# EAGLE board raspi_zero_power_sensor_hat (EAGLE 7.7.0)
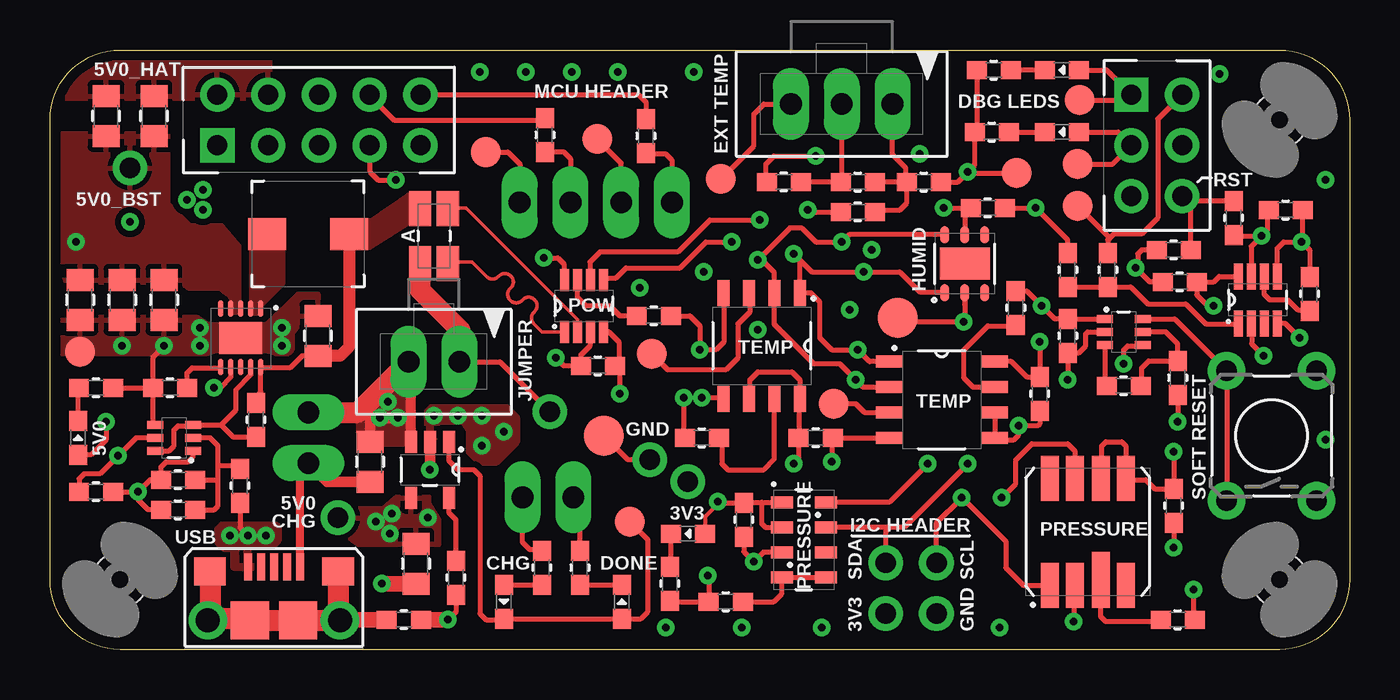
[diagram p7: board, top side]
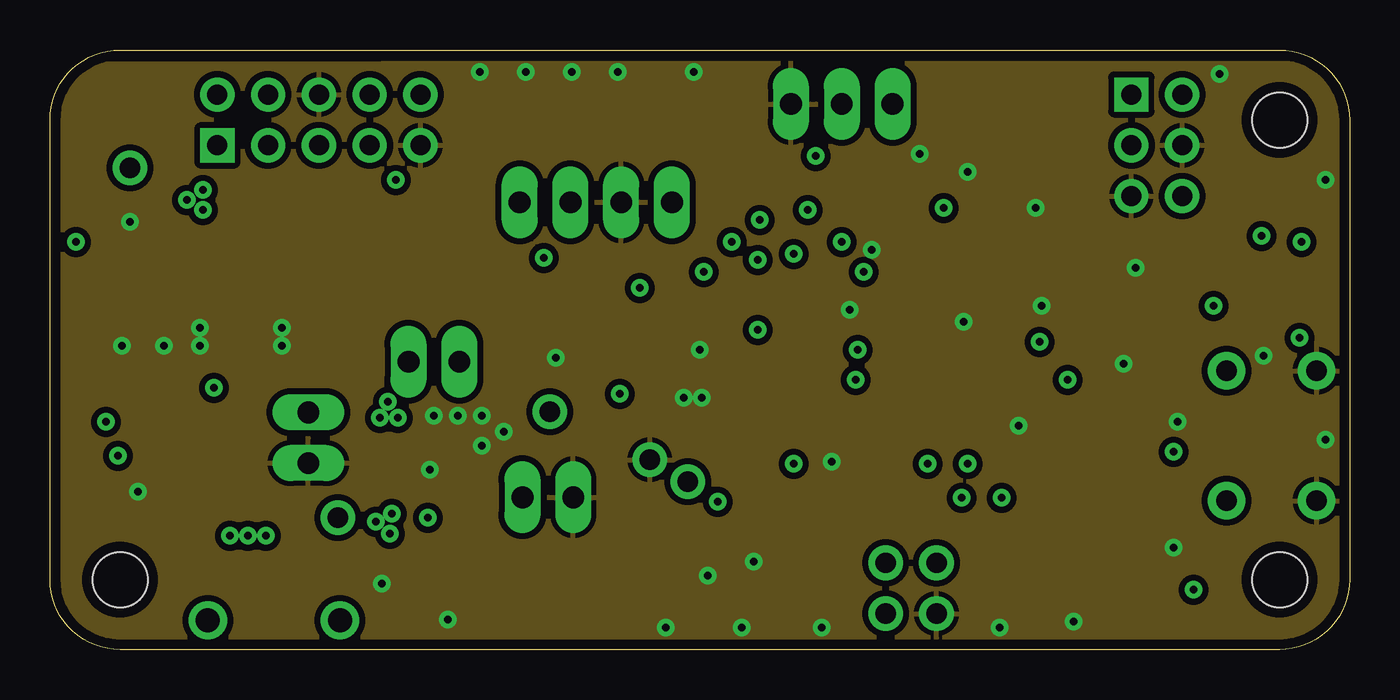
[diagram p8: board, inner layer GND]
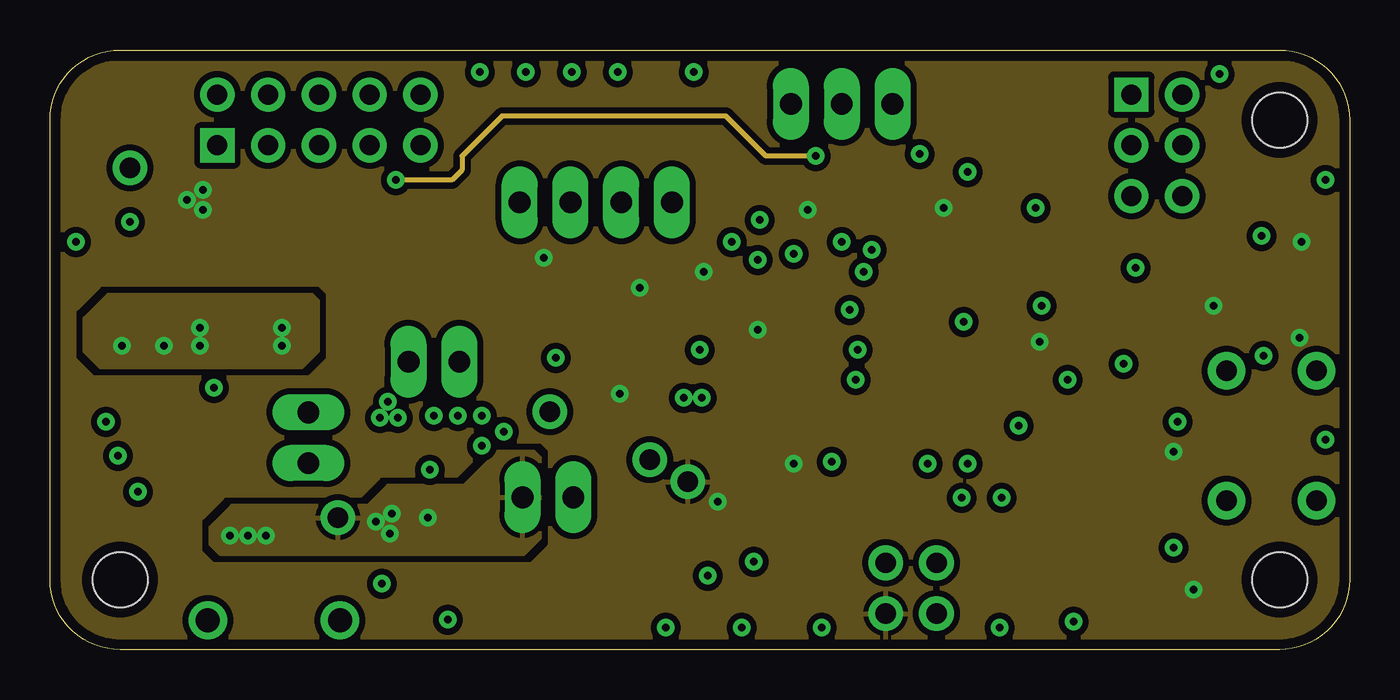
[diagram p9: board, inner layer PWR]
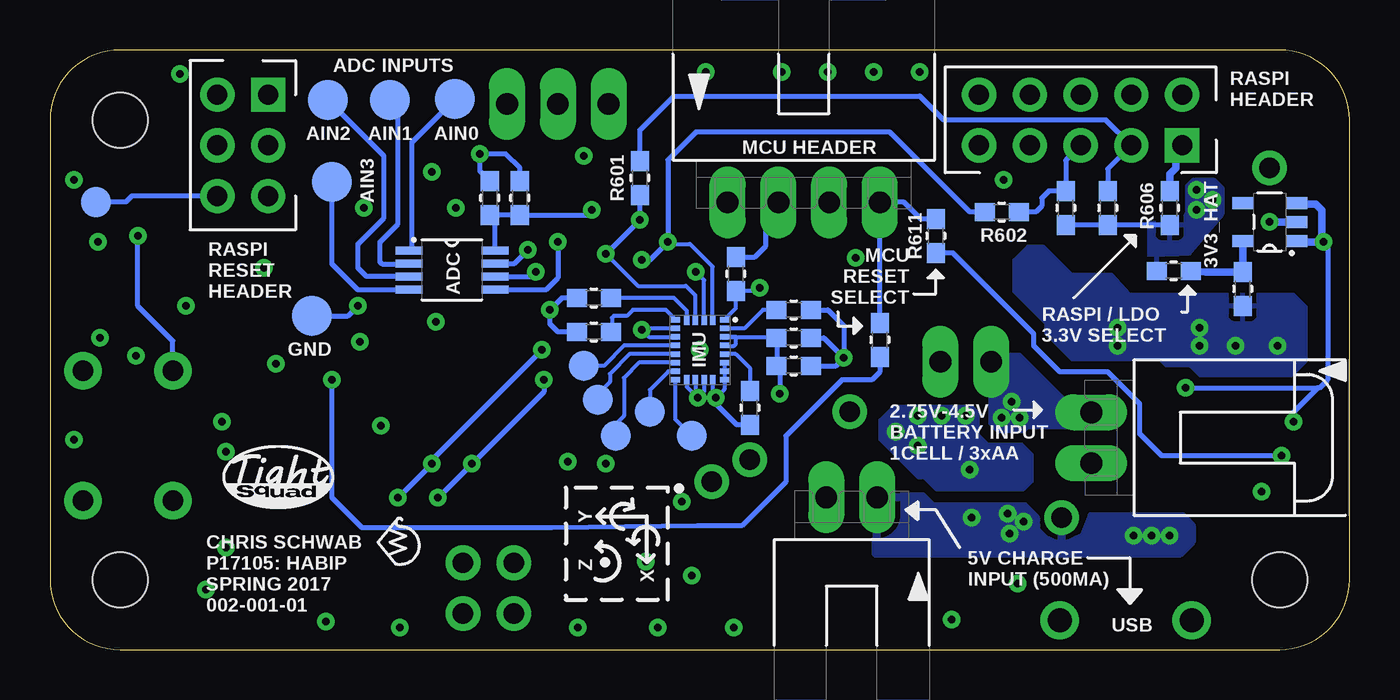
[diagram p10: board, bottom side, seen from below]

Size 65 x 30 mm. Coordinates in mm from the lower left corner, seen from the top.
Outline: 3.5,0 arc-90 0,3.5 0,26.5 arc-90 3.5,30 61.5,30 arc-90 65,26.5 65,3.5 arc-90 61.5,0 3.5,0
Copper layers (1+2*15+16): Top 0.035mm / dielectric 0.486mm / GND 0.035mm / dielectric 0.488mm / PWR 0.035mm / dielectric 0.486mm / Bottom 0.035mm
Design rules "4layer_4pcb": minimum track width 6mil, minimum drill 15mil, track to track 6mil, track to pad 6mil, pad to pad 6mil, via to via 6mil, smd to smd 6mil, copper to edge 20mil, drill to drill 10mil, minimum pad ring 14mil, minimum via ring 10mil, stop-mask expansion 2.5mil, vias tented up to drill 16mil, thermal gap 10mil
Net classes: 0 default: drill 0.381 mm, clearance 0.152 mm; 1 diff_pair: width 0.178 mm, drill 0.381 mm, clearance 0.178 mm

## Footprints (pad centres in the part's own frame; a part is rotated, then mirrored left to right if it is on the bottom)
C0805 = smd 1.1 x 1.35: 1 -1,0; 2 1,0
C0603 = smd 1 x 0.9: 1 -0.85,0; 2 0.85,0
LED0603 = smd 1 x 0.9: 1 -0.85,0; 2 0.85,0
R0603 = smd 1 x 0.9: 1 -0.85,0; 2 0.85,0
MOLSL-2-RA_HALF = drill 1.09 long: 1 -1.27,-7.62; 2 1.27,-7.62
MICROUSB-RIGHT = smd 0.4 x 1.35: 1 -1.3,2.675; 2 -0.65,2.675; 3 0,2.675; 4 0.65,2.675; 5 1.3,2.675 | drill 1.2 pad 1.6: S1 -3.3,0; S2 3.3,0 | smd 1.6 x 1.4: S3 -3.2,2.45; S4 3.2,2.45 | smd 1.9 x 1.9: S5 -1.2,0; S6 1.2,0
MOLSL-2-RA = drill 1.09 long: 1 -1.27,-7.62; 2 1.27,-7.62
MOLSL-2-V = drill 1.09 long: 1 -1.27,0; 2 1.27,0
RECEPTACLE-2X5-254MM = drill 1 pad 1.5 square: 1 -5.08,-1.27 | drill 1 pad 1.5: 2 -5.08,1.27; 3 -2.54,-1.27; 4 -2.54,1.27; 5 0,-1.27; 6 0,1.27; 7 2.54,-1.27; 8 2.54,1.27; 9 5.08,-1.27; 10 5.08,1.27
MOLSL-4-RA_HALF = drill 1.09 long: 1 -3.81,-7.62; 2 -1.27,-7.62; 3 1.27,-7.62; 4 3.81,-7.62
MOLSL-3-V = drill 1.09 long: 1 -2.54,0; 2 0,0; 3 2.54,0
RECEPTACLE-2X3-254MM = drill 1 pad 1.5 square: 1 -2.54,-1.27 | drill 1 pad 1.5: 2 -2.54,1.27; 3 0,-1.27; 4 0,1.27; 5 2.54,-1.27; 6 2.54,1.27
SMD410P190X160-2N = smd 1.9 x 1.6: 1 -2.05,0; 2 2.05,0
RASPI_ZERO_3STANDOFFS_ONLY = hole 2.75: 3.5,3.5; 61.5,3.5; 61.5,26.5
SOT363P080X040-6N = smd 0.8 x 0.4: 1 -0.95,0.65; 2 -0.95,0; 3 -0.95,-0.65; 4 0.95,-0.65; 5 0.95,0; 6 0.95,0.65
RS1206 = smd 1.75 x 1.1: 1A -1.375,-0.7; 1V -1.375,0.7; 2A 1.375,-0.7; 2V 1.375,0.7
R0805 = smd 1.1 x 1.35: 1 -1,0; 2 1,0
TACTILE-PTH = drill 1.016 pad 1.88: 1 3.25,-2.25; 2 -3.25,-2.25; 3 3.25,2.25; 4 -3.25,2.25
TP_TH102 = drill 1.02: 1 0,0
TP20R = smd 2 x 2: TP 0,0
TP15R = smd 1.5 x 1.5: TP 0,0
SOT23P110X060-5N = smd 1.1 x 0.6: 1 -1.4,0.95; 2 -1.4,0; 3 -1.4,-0.95; 4 1.4,-0.95; 5 1.4,0.95
SOT23P130X045-8N = smd 1.3 x 0.45: 1 -1.175,0.975; 2 -1.175,0.325; 3 -1.175,-0.325; 4 -1.175,-0.975; 5 1.175,-0.975; 6 1.175,-0.325; 7 1.175,0.325; 8 1.175,0.975
SOT23P105X060-5N = smd 1.05 x 0.6: 1 -1.35,0.95; 2 -1.35,0; 3 -1.35,-0.95; 4 1.35,-0.95; 5 1.35,0.95
DRC0010G_SM = smd 0.825 x 0.28: 1 -1.462,1; 2 -1.462,0.5; 3 -1.462,0; 4 -1.462,-0.5; 5 -1.462,-1; 6 1.462,-1; 7 1.462,-0.5; 8 1.462,0; 9 1.462,0.5; 10 1.462,1 | smd 1.6 x 2.15: 11 0,0
SOIC127P130X0600-8N = smd 1.3 x 0.6: 1 -2.65,1.905; 2 -2.65,0.635; 3 -2.65,-0.635; 4 -2.65,-1.905; 5 2.65,-1.905; 6 2.65,-0.635; 7 2.65,0.635; 8 2.65,1.905
SOP65P135X040-8N = smd 1.35 x 0.4: 1 -2.15,0.975; 2 -2.15,0.325; 3 -2.15,-0.325; 4 -2.15,-0.975; 5 2.15,-0.975; 6 2.15,-0.325; 7 2.15,0.325; 8 2.15,0.975
SOT65P110X045-8N = smd 1.1 x 0.45: 1 -1.3,0.975; 2 -1.3,0.325; 3 -1.3,-0.325; 4 -1.3,-0.975; 5 1.3,-0.975; 6 1.3,-0.325; 7 1.3,0.325; 8 1.3,0.975
LGA043P045X033-24N = smd 0.275 x 0.45: 1 -1.505,1.225; 6 -1.505,-1.225; 7 -1.075,-1.225; 8 -0.645,-1.225; 9 -0.215,-1.225; 10 0.215,-1.225; 11 0.645,-1.225; 12 1.075,-1.225; 13 1.505,-1.225; 18 1.505,1.225; 19 1.075,1.225; 20 0.645,1.225; 21 0.215,1.225; 22 -0.215,1.225; 23 -0.645,1.225; 24 -1.075,1.225 | smd 0.45 x 0.275: 2 -1.475,0.645; 3 -1.475,0.215; 4 -1.475,-0.215; 5 -1.475,-0.645; 14 1.475,-0.645; 15 1.475,-0.215; 16 1.475,0.215; 17 1.475,0.645
SMD125P110X060-8N = smd 1.1 x 0.6: 1 -1.1,1.875; 2 -1.1,0.625; 3 -1.1,-0.625; 4 -1.1,-1.875; 5 1.1,-1.875; 6 1.1,-0.625; 7 1.1,0.625; 8 1.1,1.875
SMD125130P225X090-8N = smd 2.25 x 0.9: 1 -2.675,1.9; 2 -2.675,0.65; 4 -2.675,-1.9; 5 2.675,-1.9; 6 2.675,-0.65; 7 2.675,0.65; 8 2.675,1.9 | smd 2.8 x 0.9: 3 -2.4,-0.65
DFN-100P085X045-T-6N = smd 0.85 x 0.45: 1 -1.45,1; 2 -1.45,0; 3 -1.45,-1; 4 1.45,-1; 5 1.45,0; 6 1.45,1 | smd 1.6 x 2.5: PAD 0,0

## Placement (x,y rotation side)
BOM701  SL 70066 2PIN HOUSING  [BLANK]  61.72,10.1 90 top
BOM702  SL 70058 GOLD CRIMP  [BLANK]  61.73,10 90 top
BOM703  SL 70058 GOLD CRIMP  [BLANK]  61.84,10.1 90 top
BOM704  SL 70066 2PIN HOUSING  [BLANK]  61.75,10 90 top
BOM705  SL 70058 GOLD CRIMP  [BLANK]  61.76,10 90 top
BOM706  SL 70058 GOLD CRIMP  [BLANK]  61.57,10 90 top
BOM707  SL 70066 2PIN HOUSING  [BLANK]  61.8,10.1 90 top
BOM708  SL 70058 GOLD CRIMP  [BLANK]  61.7,10.1 90 top
BOM709  SL 70058 GOLD CRIMP  [BLANK]  61.6,10.1 90 top
BOM710  HEADER-RECT-MALE-2X5  [BLANK]  61.75,10 90 top
BOM711  SL 70066 4PIN HOUSING  [BLANK]  61.7,10 90 top
BOM712  SL 70058 GOLD CRIMP  [BLANK]  61.65,10.1 90 top
BOM713  SL 70058 GOLD CRIMP  [BLANK]  61.76,10.1 90 top
BOM714  SL 70058 GOLD CRIMP  [BLANK]  61.68,10.1 90 top
BOM715  SL 70058 GOLD CRIMP  [BLANK]  61.69,10 90 top
BOM716  SL 70066 3PIN HOUSING  [BLANK]  61.62,10 90 top
BOM717  SL 70058 GOLD CRIMP  [BLANK]  61.73,10 90 top
BOM718  SL 70058 GOLD CRIMP  [BLANK]  61.74,10.1 90 top
BOM719  SL 70058 GOLD CRIMP  [BLANK]  61.75,10 90 top
BOM720  1-Wire Temperature Sensor  [BLANK]  61.76,10 90 top
BOM721  1-Wire Temperature Sensor  [BLANK]  61.67,10 90 top
BOM722  HEADER-RECT-MALE-2X3  [BLANK]  61.69,10.1 90 top
C301  10uF  [C0805]  18.3,4.3 270 top
C302  100nF  [C0603]  56.5,18.4 180 top
C401  10uF  [C0805]  16,9.4 270 top
C402  100nF  [C0603]  5.35,18.05 270 bottom
C403  22uF  [C0805]  13.4,15.7 90 top
C404  2.2uF  [C0603]  6.4,8.5 180 top
C405  18nF  [C0603]  6,13.1 180 top
C406  10uF  [C0805]  5.7,17.5 270 top
C407  10uF  [C0805]  3.6,17.5 270 top
C408  10uF  [C0805]  1.5,17.5 270 top
C501  100nF  [C0603]  49.5,12.8 90 top
C502  100nF  [C0603]  38.3,10.6 180 top
C503  100nF  [C0603]  43,22.6 90 bottom
C504  4.7uF  [C0603]  41.5,22.6 90 bottom
C505  10nF  [C0603]  30,12.1 270 bottom
C506  100nF  [C0603]  27.4,14.2 0 top
C507  100nF  [C0603]  27.8,15.6 0 bottom
C508  100nF  [C0603]  27.8,17 0 bottom
C509  10uF  [C0603]  27.8,14.2 0 bottom
C510  100nF  [C0603]  30.7,18.8 90 bottom
C511  100nF  [C0603]  56.2,7.2 90 top
C512  100nF  [C0603]  34.7,6.5 90 top
C513  100nF  [C0603]  46.9,22.1 180 top
C601  100nF  [C0603]  56.2,20 180 top
C602  100nF  [C0603]  43.7,23.4 0 top
DS301  YELLOW  [LED0603]  22.7,2.4 90 top
DS302  GREEN  [LED0603]  28.6,2.4 270 top
DS401  BLUE  [LED0603]  1.4,10.6 270 top
DS402  YELLOW  [LED0603]  31.9,5.8 0 top
DS601  YELLOW  [LED0603]  50.6,29 0 top
DS602  YELLOW  [LED0603]  50.6,25.9 0 top
F601  FUSE-50MA  [R0603]  40.4,21.9 180 top
J301  MOL-SL-2-RA  [MOLSL-2-RA_HALF]  24.9,0 180 bottom
J302  USB_MICROB_RECPT  [MICROUSB-RIGHT]  11.2,1.47 0 top
J401  MOL-SL-2-RA  [MOLSL-2-RA]  5.3,10.6 270 bottom
J402  MOL-SL-2-V  [MOLSL-2-V]  19.2,14.4 180 top
J601  RECEPTACLE-2x5-2.54MM  [RECEPTACLE-2X5-254MM]  13.45,26.5 0 top
J602  MOL-SL-4-RA  [MOLSL-4-RA_HALF]  27.3,30 0 bottom
J603  MOL-SL-3-V  [MOLSL-3-V]  39.6,27.3 180 top
J604  RECEPTACLE-2x3-2.54MM  [RECEPTACLE-2X3-254MM]  55.36,25.23 270 top
L401  1.0uH  [SMD410P190X160-2N]  12.9,20.8 180 top
LOGO601  [CMS_LOGO]  48.3,4.5 0 bottom
LOGO602  [SQUAD_LOGO]  56.4,7 0 bottom
OUTLINE601  RASPI_ZERO_OUTLINE_3S0C_ONLY  [RASPI_ZERO_3STANDOFFS_ONLY]  0,0 0 top
Q301  SSM6N7002KFU  [SOT363P080X040-6N]  53.7,15.9 0 top
Q401  SSM6N7002KFU  [SOT363P080X040-6N]  6.2,10.6 180 top
R301  0.0  [R0603]  17.7,1.5 180 top
R302  2k  [R0603]  20.3,3.6 90 top
R303  2k  [R0603]  24.6,4.1 90 top
R304  2k  [R0603]  26.5,4.1 270 top
R305  0.0  [R0603]  53.7,13.2 180 top
R306  0.0  [R0603]  56.4,13.6 270 top
R307  0.0  [R0603]  52.9,19 270 top
R308  0.0  [R0603]  63,17.8 90 top
R309  10k  [R0603]  50.9,19 270 top
R310  10k  [R0603]  50.9,15.7 270 top
R311  10k  [R0603]  61.8,22 0 top
R312  49.9  [R0603]  59.2,21.6 90 top
R401  0.0  [R0603]  8.8,18.95 180 bottom
R402  0.033  [RS1206]  19.2,20.7 270 top
R403  49.9  [R0603]  9.5,8.2 90 top
R404  10k  [R0603]  6.4,7 0 top
R405  10k  [R0603]  10.3,11.5 90 top
R406  10k  [R0603]  2.3,7.9 180 top
R407  2k  [R0603]  2.3,13.1 180 top
R408  0.0  [R0805]  5.2,26.7 90 top
R409  0.0  [R0805]  2.8,26.7 90 top
R410  2k  [R0603]  31,3.3 90 top
R501  0.0  [R0603]  32.6,10.6 0 top
R502  0.0  [R0603]  48.3,17.1 270 top
R503  0.0  [R0603]  37.8,15.9 0 bottom
R504  0.0  [R0603]  30.2,16.7 180 top
R505  0.0  [R0603]  37.8,17.6 0 bottom
R506  0.0  [R0603]  56.4,1.5 0 top
R507  0.0  [R0603]  33.8,2.4 0 top
R601  0.0  [R0603]  35.5,23.6 90 bottom
R602  0.0  [R0603]  17.4,21.9 0 bottom
R603  2k  [R0603]  12.1,22.1 270 bottom
R604  2k  [R0603]  14.2,22.1 270 bottom
R605  0.0  [R0603]  36.7,23.4 180 top
R606  0.0  [R0603]  9,22.1 90 bottom
R607  2k  [R0603]  47.2,29 0 top
R608  2k  [R0603]  47.1,25.9 0 top
R609  0.0  [R0603]  24.75,25.75 270 top
R610  0.0  [R0603]  29.8,25.7 270 top
R611  0.0  [R0603]  20.7,20.7 270 bottom
R612  0.0  [R0603]  23.5,15.5 270 bottom
R613  4.7k  [R0603]  40.4,23.4 0 top
S301  PB  [TACTILE-PTH]  61.1,10.7 90 top
TP301  [TP_TH102]  14.4,6.6 0 top
TP302  [TP_TH102]  30,9.5 0 top
TP303  [TP20R]  27.7,10.7 0 top
TP304  [TP15R]  29,6.4 0 top
TP401  [TP_TH102]  25,11.9 0 top
TP402  [TP_TH102]  31.9,8.4 0 top
TP403  [TP_TH102]  4,24.1 0 top
TP404  [TP15R]  1.5,14.9 0 top
TP501  [TP20R]  50.9,23.4 180 bottom
TP502  [TP20R]  51.1,27.5 180 bottom
TP503  [TP20R]  48,27.5 180 bottom
TP504  [TP20R]  44.75,27.55 180 bottom
TP505  [TP20R]  51.9,16.7 180 bottom
TP506  [TP15R]  39.2,12.3 0 top
TP507  [TP15R]  30.1,14.8 0 top
TP508  [TP15R]  38.3,14.2 0 bottom
TP509  [TP15R]  37.6,12.5 0 bottom
TP510  [TP15R]  36.7,10.7 0 bottom
TP511  [TP15R]  35,11.9 0 bottom
TP512  [TP15R]  32.9,10.7 0 bottom
TP513  [TP20R]  42.4,16.6 0 top
TP601  [TP_TH102]  41.8,1.8 0 top
TP602  [TP_TH102]  41.8,4.34 0 top
TP603  [TP_TH102]  44.34,4.34 0 top
TP604  [TP_TH102]  44.34,1.8 0 top
TP605  [TP15R]  51.5,27.5 0 top
TP606  [TP15R]  51.4,24.3 0 top
TP607  [TP15R]  21.81,24.89 90 top
TP608  [TP15R]  27.37,25.55 90 top
TP609  [TP15R]  51.4,22.2 90 top
TP610  [TP15R]  33.56,23.55 90 top
TP611  [TP15R]  62.71,22.39 90 bottom
TP612  [TP15R]  48.35,23.85 90 top
U301  MCP73831T-2AC  [SOT23P110X060-5N]  19,9 270 top
U302  MAX6371  [SOT23P130X045-8N]  60.4,17.5 90 top
U401  TLV71333P  [SOT23P105X060-5N]  4,21.4 180 bottom
U402  TPS61232  [DRC0010G_SM]  9.54,15.6 270 top
U501  PCT2075D,118  [SOIC127P130X0600-8N]  44.6,12.5 0 top
U502  PCT2075D,118  [SOIC127P130X0600-8N]  35.6,15.2 270 top
U503  MAX11613EUA+  [SOP65P135X040-8N]  44.9,19 0 bottom
U504  INA219AIDCNR  [SOT65P110X045-8N]  26.7,17.2 90 top
U505  LSM9DS1TR  [LGA043P045X033-24N]  32.5,15 270 bottom
U506  MS560702BA03-50  [SMD125P110X060-8N]  37.7,5.5 0 top
U507  MS580305BA01  [SMD125130P225X090-8N]  51.9,5.9 90 top
U508  SI7021  [DFN-100P085X045-T-6N]  45.75,19.31 90 top

## Tracks (layer width: path | path; a pad name or v marks a point on that pad's centre or on a via)
3V3_HAT_PG
  Top 0.254: 31,5.75 DS402.1 31.05,4.2 R410.2
5V0_BST_PG
  Top 0.203: 1.4,13.05 R407.2
  Top 0.254: DS401.1 1.4,13.05
ADC_AIN0
  Bottom 0.254: TP504.TP 46.9,25.4 46.9,20.12 U503.1
ADC_AIN1
  Bottom 0.254: TP503.TP 47.6,27.1 47.6,21.3 48.5,20.4 48.5,19.4 48.4,19.3 47.08,19.3 U503.2
ADC_AIN2
  Bottom 0.254: TP502.TP 48.3,24.7 48.3,21.6 49.6,20.3 49.6,19.1 49.17,18.68 U503.3
ADC_AIN3_REF
  Bottom 0.254: U503.4 47.08,18 49.6,18 50.9,19.3 TP501.TP
BST_EN
  Top 0.203: 7.1,11.2 Q401.3 | 10.05,10.9 R405.1 10.25,10.9
  Top 0.254: Q401.6 5.95,9.95 6.2,10.2 6.2,11 6.4,11.2 7.1,11.2 | Q401.3 8.55,11.25 | 8.55,11.25 9.15,10.65 R405.1 | 8.55,11.25 9.3,12 9.3,13 10.04,13.74 U402.9
BST_SS
  Top 0.203: C405.1 6.85,13.25
  Top 0.254: 6.85,13.25 6.85,13.85 7.1,14.1 8.5,14.1 U402.6
BST_SW
  pour Top (isolate 0.305, no thermals): 10,21.5 10,16.8 10.6,16.8 10.6,17.2 11.7,18.3 11.7,21.5
CHG_DISABLE_GATE
  Top 0.203: C404.1 7.6,8.5
  Top 0.254: R404.2 8.2,7 8.4,7.2 8.4,8.5 | 8.4,8.5 8.4,9.2 | 8.4,9.2 8.4,10.2 8,10.6 Q401.2 | C404.1 8.4,8.5 | R403.2 9.35,9.2 8.4,9.2
CHG_DONE
  Top 0.254: R304.2 DS302.1
CHG_ON
  Top 0.254: DS301.2 R303.1
CHG_PROG
  Top 0.203: U301.5 19.95,7.25
  Top 0.254: R302.2 20.3,6.5 19.95,6.85 U301.5
CHG_STAT
  Top 0.254: U301.1 19.95,9.45 20.4,9 21.2,9 21.5,8.7 21.5,1.8 21.8,1.5 22.65,1.5 DS301.1 DS302.2 29.55,1.55 29.9,1.9 29.9,5.5 TP304.TP
DBG_LED0
  Top 0.254: DS601.1 R607.2
DBG_LED1
  Top 0.254: R608.2 DS602.1
FET_D
  Top 0.203: 52.75,13.3 R305.2
  Top 0.254: Q301.3 52.75,13.3
FET_G
  Top 0.254: Q301.5 55.8,15.9 56.4,15.3 R306.1 54.95,14.45 54.6,14.1 54.6,13.25 R305.1
GND  (via drill 0.38)
  Top 0.203: 60.1,16.3 U302.2 | 54.6,15.2 Q301.4 | C601.2 55.2,20 | 46.35,26 R608.1 | 32.9,2.45 R507.1 | 18,3.6 C301.2 | 19.1,10.5 U301.2 | 5.25,13 C405.2
  Top 0.254: v53.7,14.3 53.7,15 53.9,15.2 54.6,15.2 | Q301.1 R310.1 50.25,16.55 v49.6,17.2 48.85,17.95 R502.1 | C302.2 55,18.4 v54.3,19.1 54.4,19.2 54.4,19.8 54.6,20 55.2,20 | R607.1 46.35,26 | R406.1 v4.4,7.9 | R410.1 31.05,2.4 R507.1 32.95,3.65 v32.9,3.7 | TP513.TP 42.6,16.4 v45.7,16.4 45.75,16.45 U508.2 45.75,17.25 | TP610.TP 35.2,25.19 35.2,26.8 35.7,27.3 J603.3 | v45.9,23.9 46.25,24.25 R608.1 | C602.2 45.4,23.4 v45.9,23.9 | TP302.1 28.9,9.5 TP303.TP | R302.1 20.3,1.9 v19.9,1.5 | R407.1 C405.2 | Q401.4 5.15,11.35 C405.2 | C405.2 5.15,14.65 v5.7,15.2 | U507.2 51.2,3.17 v51.2,1.4 | C511.1 56.05,6.2 56.2,6.05 v56.2,5.1 | R306.2 v56.4,11.4 | 60.1,16.3 60.1,15.3 v60.7,14.7 | U504.3 27.02,15.22 26.55,14.75 C506.1 25.7,14.2 v25.3,14.6 | v39.1,9.4 39.1,10.55 C502.1 U501.4 | R501.1 31.7,10.65 v31.7,12.6 | v45.9,23.9 45.95,23.85 TP612.TP | C513.1 v49.3,22.1 50.9,20.5 R309.1 | C512.1 34.7,4.9 v35.2,4.4 35.67,4.88 U506.3 | v4.4,7.9 5,8.5 C404.2 5.55,9.15 5.8,9.4 6.9,9.4 7.15,9.65 Q401.1 | R404.1 4.9,7 4.4,7.5 v4.4,7.9 | J602.2 28.57,24.35 TP608.TP | C501.1 49.5,11.3 49.4,11.2 v48.45,11.2 48.45,10.75 48.2,10.5 47.34,10.5 U501.5 U501.6 | U502.5 33.65,12.6 v32.6,12.6 | U502.4 33.7,15.4 33.3,15 v32.5,15 32.5,16.2 32,16.7 R504.1 | R304.1 26.5,7.29 J301.2
  Top 0.4: J302.5 12.5,8.91 J401.2
  Top 0.525: U301.2 v19,9 | C401.2 13.85,8.4 J401.2
  Top 0.781: R301.1 v19.9,1.5 | v16.6,3.3 C301.2
  Bottom 0.203: U505.14 33.15,13.14 v32.6,12.6 | U505.15 32.72,12.71 v32.6,12.6 | U505.16 32.28,12.91 v32.6,12.6 | U505.17 31.86,12.76 v31.7,12.6 31.27,13.03 U505.18 U505.19 U505.20
  Bottom 0.254: R505.1 39.4,17.6 v40,17 40,16.3 39.6,15.9 R503.1 | C509.2 25.7,14.2 v25.3,14.6 | J602.2 29.2,21.75 29.2,20.2 29.75,19.65 C510.2 | TP505.TP 50.1,16.7 v49.6,17.2 | U503.7 41.77,19.32 v41.1,20 | C503.2 43.5,23.95 v43.5,24.8 42.2,24.8 41.5,24.1 C504.2 | C508.2 26.1,17 25.3,16.2 v25.3,14.6 | C507.2 26.3,15.6 v25.3,14.6 | C505.2 30.65,11.25 31.7,12.3 v31.7,12.6
  Bottom 0.381: U401.2 v4,21.4
  other vias: 7.5,15.2 7.5,16.1 11.6,16.1 11.6,15.2 19.2,11.7 21.5,28.9 23.8,28.9 26.1,28.9 28.4,28.9 32.2,28.9 30.8,1.1 34.6,1.1 38.6,1.1 47.5,1.1 63.8,10.5 63.8,23.5 58.5,28.8 3.6,15.2 20.4,11.7 21.6,11.7 22.7,10.9 21.6,10.2
  pour Bottom (isolate 0.305): 11.9,18.8 11,17.8 2.8,17.8 2.2,17.2 2.2,14.4 2.9,13.7 7.5,13.7 8,14.2 9.2,14.2 9.5,14.5 13.9,14.5 15.2,15.8 15.2,16.3 16.8,17.9 16.8,19.5 16.1,20.2 15.3,20.2 13.9,18.8
  pour Top: 7.94,16.27 10.8,16.27 12.4,17.8 13.4,17.8 13.4,16.3 12.4,16.2 12.1,15.8 12.1,15 11.9,14.8 11.3,14.8 10.93,14.93 8.2,14.93 7.8,14.8 0.6,14.8 0.6,16.66 7.35,16.63
  pour PWR (isolate 0.305): 7.3,17.8 13.1,17.8 13.4,17.5 13.4,14.9 12.6,14.1 2.5,14.1 1.7,14.9 1.7,16.6 2.9,17.8
  pour Top (isolate 0.305): 18.9,10.6 18.9,11.9 19.1,12.1 22.8,12.1 23.3,11.6 23.3,10.4 22.3,9.4 21.5,9.4 21,9.9 21,11 20.72,11.43 19.32,11.43 19.3,11.1 19.2,11 19.2,10.6
  pour Bottom (isolate 0.305): 18.6,11.9 18.6,10.8 18.1,10.3 16.4,10.3 15.9,9.8 15.9,8.4 16.3,8 20.7,8 21.3,8.6 21.6,8.6 22.7,9.7 23.5,10.5 23.5,11.5 22.8,12.2 18.9,12.2
  pour GND (isolate 0.305): 0.6,29.3 0.6,0.6 64.4,0.6 64.4,29.4
I2C1_RASPI_SCL  (via drill 0.38)
  Top 0.203: v35.4,19.5 35.6,19.5 | 45.62,7.6 v45.6,7.6
  Top 0.254: 35.6,19.5 36.2,18.9 36.2,17.89 U502.2 36.23,16.27 38.2,14.3 39.5,14.3 v40.3,13.5 40.66,13.13 U501.2 | v35.4,19.5 37,21.1 37.6,21.1 38.3,20.4 v39.6,20.4 39.96,20.76 U508.6 | U506.8 41.98,7.38 v43.9,9.3 | TP603.1 44.34,6.34 v45.6,7.6 | v34.1,20.4 32.8,20.4 31.5,19.1 28.8,19.1 28.3,18.6 27.77,18.6 U504.5 | 45.62,7.6 47.8,5.42 47.8,4.1 48.67,3.23 U507.1
  Bottom 0.203: U505.2 31.86,19.16 33,20.3 34,20.3 v34.1,20.4
  Bottom 0.254: v35.4,19.5 35,19.5 v34.1,20.4 34.1,24.5 32.7,25.9 23,25.9 19,21.9 R602.1 | v45.6,7.6 v43.9,9.3 40.3,12.9 v40.3,13.5 | U503.5 40.17,18.02 39.6,18.6 v39.6,20.4
I2C1_RASPI_SCL_R
  Bottom 0.254: J601.5 14.2,24.48 R604.1 15.05,22.95 15.4,22.6 15.4,22.2 15.7,21.9 R602.2
I2C1_RASPI_SDA  (via drill 0.38)
  Top 0.254: 42,6.12 U506.7 | TP602.1 41.8,5.92 42,6.12 | 27.1,18.43 U504.6 | 27,18.48 U504.6 | v37.2,19.8 37.41,19.59 | v35.5,21.5 33,21.5 31.4,19.9 27.5,19.9 27,19.4 27,18.52 U504.6 | v47.6,7.6 48.3,8.3 48.3,9.5 49.1,10.3 50.9,10.3 51.25,9.95 U507.7 | v45.9,9.3 42.73,6.12 42,6.12 | U508.1 44.71,17.9 43.5,17.9 42.5,18.9 v40.7,18.9 38.1,18.9 v37.2,19.8 | U501.1 40.99,14.4 v40.4,15 39.1,15 38.5,15.6 38.5,17.4 38.05,17.85 U502.1 37.51,19.5 v37.2,19.8
  Bottom 0.203: U505.4 32.72,17.71 33.2,18.2 35.6,18.2 v37.2,19.8
  Bottom 0.254: v37.2,19.8 v35.5,21.5 R601.1 | v47.6,7.6 v45.9,9.3 45.9,9.5 v40.4,15 | U503.6 40.92,18.68 v40.7,18.9
I2C1_RASPI_SDA_R
  Bottom 0.254: R601.2 35.5,26 33.8,27.7 21.5,27.7 20.3,26.5 12.18,26.5 J601.3 12.1,24.04 R603.1
IMON_A0
  Top 0.254: 26.4,18.48 U504.7 26.38,17.62 26.8,17.2 28,17.2 28.5,16.7 R504.2
IMU_C1
  Bottom 0.203: U505.24 30.27,16.07 29.35,17 C508.1
IMU_CAP
  Bottom 0.203: U505.21 30.69,14.78 30,14.1 C505.1
IMU_DEN_AG
  Bottom 0.203: TP512.TP 33.73,11.53 U505.13
IMU_DRDY_M
  Bottom 0.203: U505.9 36.28,15.21 37.3,14.2 TP508.TP
IMU_INT1_AG
  Bottom 0.203: U505.11 35.55,14.36 36.3,13.6 36.3,11.7 36.7,11.3 TP510.TP 36.3,10.7
IMU_INT2_AG
  Bottom 0.203: U505.12 34.08,13.93 35,13 TP511.TP
IMU_INT_M
  Bottom 0.203: U505.10 36.02,14.79 37,13.8 37,13.4 37.6,12.8 TP509.TP
IMU_SDO_AG
  Bottom 0.203: U505.5 33.15,16.95 33.8,17.6 R505.2
IMU_SDO_M
  Bottom 0.203: U505.6 33.73,16.52 34.2,17 35.85,17 36.15,16.7 36.8,16.7 36.9,16.6 36.9,15.95 R503.2
MCU_TO_BST_RESET  (via drill 0.38)
  Top 0.203: 1.45,8.25 R406.2
  Top 0.254: Q401.5 4.3,10.6 v3.4,9.7 2.5,8.8 1.7,8.8 1.45,8.55 R406.2
  Bottom 0.254: v3.4,9.7 9.4,9.7 10.5,10.8 10.5,12.3 12.1,13.9 14.5,13.9 15.8,15.2 15.8,15.8 19.85,19.85 R611.2
MCU_TO_HAT_RESET
  Top 0.203: J602.4
  Top 0.254: TP607.TP 22.91,24.89 23.5,24.3 J602.4
  Bottom 0.254: R612.1 J602.4 22.28,22.38 21.45,21.55 R611.1
MCU_TO_RASPI_RESET  (via drill 0.38)
  Top 0.254: v50.9,13.5 R310.2 51.45,14.85 51.8,15.2 51.8,15.8 51.9,15.9 Q301.2
  Bottom 0.254: v50.9,13.5 50.9,7.6 49.4,6.1 39.9,6.1 32.6,6.2 30.4,6.2 28.2,8.4 28.2,10.7 25.4,13.5 23.9,13.5 23.5,13.9 R612.2
PP3V3_HAT  (via drill 0.38)
  Top 0.203: 52.5,8.62 U507.6 | 36.48,7.5 U506.1 | U506.2 36.52,6.05 | 45.8,20.81 U508.5 | 33.45,7.35 32.75,6.65 DS402.2
  Top 0.254: U507.6 52.6,8.62 52.6,10.2 52.8,10.4 53.6,10.4 53.8,10.2 U507.5 53.88,8.5 54.8,8.5 55.25,8.05 C511.2 v56.2,9.9 | R506.2 57.2,1.55 v57.2,3 | v62.6,20.4 63,20 R308.2 | v62.6,20.4 62.65,20.45 R311.2 | v62.5,15.6 61.77,16.32 U302.4 | v28.5,12.8 28.5,13.95 C506.2 28.45,14.4 28.45,15.4 27.95,15.9 U504.4 | v24.7,19.6 25.4,19.6 25.7,19.3 25.7,18.52 U504.8 | v37.2,9.3 37.45,9.55 C502.2 37.45,12.49 U502.8 37.51,13.49 37.1,13.9 35.4,13.9 35,13.5 35,12.59 U502.6 | v44.7,22.1 C513.2 45.75,21.8 U508.5 | v33.4,7.4 33.45,7.35 C512.2 34.8,7.1 35.08,7.38 35.6,7.38 | 35.6,7.38 U506.1 | U506.2 36.58,6.1 35.8,6.1 35.6,6.3 35.6,7.38 | v37.9,22 38,21.9 F601.2 | U302.8 58.48,18.68 58.2,18.4 C302.1 57.35,17.75 57.9,17.2 v58.2,17.2 | U302.5 61.38,20.07 61.7,20.4 v62.6,20.4 | v49.5,15.4 C501.2 48.85,13.65 48.09,14.4 U501.8
  Bottom 0.203: U505.22 30.8,15.2 30.7,15.3 30.7,15.64 U505.23 28.7,15.64 C507.1 | U505.3 32.28,18.48 v32.7,18.9 | v29.5,18.1 29.65,17.95 C510.1 30.7,17.08 U505.1 | U505.8 35.05,15.64 v35.4,16 35.33,16.07 U505.7
  Bottom 0.254: U503.8 42.75,21.5 C503.1 C504.1 38.15,21.75 v37.9,22 | R606.1 R603.2 R604.2 | v28.5,12.8 28.5,14.2 C509.1 C507.1
  other vias: 7.65,23 6.85,22.5 7.65,22
  pour Bottom (isolate 0.305): 7.8,23.5 6.8,23.5 6.4,23.1 6.4,21.8 8.09,19.79 9.4,19.79 9.4,18.6 10,18.6 10,21.35 8.4,21.35 8.1,21.9 8.1,23.2
  pour PWR (isolate 0.305, rank 2): 0.6,29.4 0.6,0.6 64.4,0.6 64.4,29.4
PP3V3_LDO
  Bottom 0.381: U401.5 C402.1 7.2,18.9 R401.1
PP3V3_RASPI
  Bottom 0.381: R606.2 9,23.8 8.7,24.1 8.7,24.9 J601.1
PP3V3_TEMP
  Top 0.203: R613.2 41.43,23.4
  Top 0.254: 42.8,23.45 C602.1 42.85,22.35 42.5,22 41.35,22 F601.1 | 42.8,23.45 42.8,24.1 42.14,24.76 J603.1 | 42.8,23.45 42.75,23.4 R613.2
PP5V0_BST  (via drill 0.38)
  Top 0.254: v2.8,11.4 2.8,10.5 2.05,9.75 DS401.2 | U402.7 9.04,13.64 8.5,13.1 v8.2,13.1
  Bottom 0.152: 1.6,13.1 1.5,13.1
  Bottom 0.254: v8.2,13.1 1.6,13.1 2.8,11.9 v2.8,11.4 | 1.5,13.1 1.1,13.5 1.1,20.2 v1.3,20.4 | U401.3 2.6,22.3
  Bottom 0.381: 2.6,22.3 1.7,22.3 1.4,22 1.4,20.5 v1.3,20.4 2.6,20.4 U401.1
  pour Top (isolate 0.305): 9.03,16.9 9.45,16.9 9.45,20.2 8.6,21.2 7,21.2 5.9,22.3 5.9,25.8 0.6,25.8 0.6,18.9 0.8,18.4 6.5,18.4 6.9,18.1 8.5,18.1 9.03,17.63
PP5V0_BST_HAT
  pour Top (isolate 0.203): -0.1,27.6 11,27.6 11,30.3 1.4,30.3 0,28.2
PP5V0_CHG_IN  (via drill 0.38)
  Top 0.254: R403.1 9.5,6.1 v9.9,5.7 | R303.2 24.55,5 24,5 23.63,5.37 J301.1
  other vias: 9,5.7 18.9,6.6 10.8,5.7 17,5.8 17.1,6.8 16.3,6.4
  pour PWR (isolate 0.305): 8,6.1 8,5.3 8.5,4.8 23.7,4.8 24.5,5.6 24.5,9.6 24.2,9.9 22.4,9.9 20.7,8.2 16.9,8.2 15.9,7.2 9.1,7.2
  pour Top (isolate 0.203): 15.4,5.2 19.5,5.22 19.5,6.5 19,7.3 19,7.67 17.3,7.68 17.24,7.63 16.6,7.1 14,7.1 14,6.2
  pour Bottom (isolate 0.305): 8.5,4.8 23.7,4.8 23.7,7.4 23.2,7.7 21.4,7.7 20.9,7.2 16.3,7.2 15.7,6.6 15.7,6 15.2,5.5 14.9,5.5 14.7,5.7 14.7,7 13.9,7 13.9,5.5 13.7,5.5 13.3,5.7 12.9,6.7 8.4,6.7 7.9,6.2 7.9,5.4
  pour Top: 8.4,6 8.4,5.4 8.7,5.1 9.2,5.1 9.2,4.14 10.1,4.13 10.1,5 10.2,5.3 11.2,5.3 11.4,5.5 11.4,6.1 11.3,6.2 8.6,6.2
PRES0_CSB
  Top 0.254: U506.5 U506.4 36.6,2.8 36.2,2.4 R507.2
PRES1_CSB
  Top 0.203: 52.7,4.6 52.7,4.5 52.55,4.35 U507.3
  Top 0.254: R506.1 55.45,1.4 52.8,1.4 52.55,1.65 U507.3
RASPI_GPIO20
  Top 0.254: DS601.2 52.86,29 J604.1 53.82,27.5 TP605.TP
RASPI_GPIO26
  Top 0.254: DS602.2 53.42,25.9 J604.3 53.16,24.3 TP606.TP
RASPI_RESET_N
  Top 0.203: 56.87,22.45 J604.6
  Top 0.254: R312.2 56.87,22.45 | C601.1 57.05,22.27 J604.6
  Bottom 0.203: 62.41,22.69 TP611.TP
  Bottom 0.254: J604.6 60.91,22.69 61.2,22.4 TP611.TP
RESET_BITE_N  (via drill 0.38)
  Top 0.254: S301.4 S301.3 56.25,16.55 Q301.6 | v60.6,20.7 60.08,20.18 U302.7 | v60.6,20.7 60.9,21 60.9,21.95 R311.1 | R312.1 arc90 59.25,20.7 v60.6,20.7
  Bottom 0.254: S301.3 58.85,15.45 60.6,17.2 v60.6,20.7
TEMP0_I2C_A0
  Top 0.254: R502.2 48.25,16.2 46.9,16.2 45.7,15 45.7,13.6 46.16,13.13 U501.7
TEMP0_OS
  Top 0.254: TP506.TP 40.3,12.3 40.73,11.87 U501.3
TEMP1_I2C_A0
  Top 0.254: R501.2 33.6,10.45 33.6,9.3 33.9,9 35.7,9 36.23,9.54 U502.7
TEMP1_OS
  Top 0.254: U502.3 35,17.82 35,16.9 34.4,16.3 34.4,14.6 33.8,14 30.9,14 TP507.TP
TEMP_1WIRE_BI
  Top 0.203: R613.1 39.6,23.45
  Top 0.254: 39.6,23.45 J603.2 | R613.1 R605.1
TEMP_1WIRE_BI_R  (via drill 0.38)
  Top 0.203: J601.7 | 35.8,23.45 R605.2
  Top 0.254: J601.7 16,23.9 16.4,23.5 v17.3,23.5 | 35.8,23.45 35.8,24.3 36.2,24.7 v38.3,24.7
  PWR 0.254: v17.3,23.5 20.1,23.5 20.6,24 20.6,24.7 22.6,26.7 33.8,26.7 35.8,24.7 v38.3,24.7
UART_RASPI_RXD_MCU_TXD
  Top 0.254: J602.1 31.11,24.49 30.8,24.8 29.85,24.8 R610.2
UART_RASPI_RXD_MCU_TXD_R
  Top 0.254: R610.1 29.8,27.4 29.43,27.77 J601.10
UART_RASPI_TXD_MCU_RXD
  Top 0.254: J602.3 26.03,24.57 25.7,24.9 R609.2
UART_RASPI_TXD_MCU_RXD_R
  Top 0.254: J601.8 15.99,27.71 17.2,26.5 24.65,26.5 R609.1
USB_SHD
  Top 0.508: J302.S5 9.94,1.47 | 12.37,1.5 J302.S6 | J302.S4 14.4,3.46
  Top 0.781: R301.2 14.54,1.5 J302.S2
  Top 1.06: 14.4,3.46 14.4,1.56 J302.S2 J302.S6 J302.S5 9.9,1.56 8,1.56 J302.S1 arc45 8,1.71 J302.S3
VBAT  (via drill 0.38)
  Top 0.5: U301.3 18.05,14.4 J402.2
  Top 0.525: C401.1 16,11.6 v17.4,11.6
  Top 1.06: J401.1 15.4,11.87 J402.2
  other vias: 16.9,12.4 16.5,11.6
  pour Top (isolate 0.305, no thermals): 15.4,11.7 15.4,10.9 16.1,10.3 18.1,10.3 18.2,13.2 17.4,14 17.2,14
  pour Bottom (isolate 0.305, no thermals): 13.8,11.1 16.1,11.1 16.3,10.9 17.6,10.9 18,11.3 18,14.7 17.9,14.8 16.5,14.8 13.8,12.1
VBAT_J
  Top 0.254: J402.1 22.5,14.4 TP401.1
  Top 1.016: R402.2A 18.5,18 20.5,16 20.5,14.43 J402.1
VBAT_R
  Top 0.203: 10.4,12.75 R405.2 | 12.84,14.24 C403.1
  Top 0.254: 10.4,12.75 10.54,12.89 U402.10 10.58,14.1 12,14.1 12.6,14.7 C403.1
  Top 0.61: L401.1 14.95,15.15 14.5,14.7 C403.1
  pour Top (no thermals): 18.9,22.8 17.9,22.8 16,21.5 14.1,21.5 14.1,20.1 16,20.1 17.9,21.3 18.9,21.3
VBAT_SNS_N
  Top 0.178: U504.2 26.38,16.52 20.8,22.1 19.93,22.1 R402.1V
VBAT_SNS_P
  Top 0.178: U504.1 24.6,15.9 24.2,16.3 arc-90 24.2,16.88 24.25,16.92 arc90 24.25,17.5 24.23,17.51 arc90 23.65,17.51 23.61,17.47 arc-90 23.03,17.47 23.01,17.49 arc-90 23.01,18.06 23.06,18.11 arc90 23.06,18.68 23.04,18.7 arc90 22.46,18.7 22.42,18.66 arc-90 21.84,18.66 21.1,19.4 19.98,19.4 R402.2V
WDT_PET
  Top 0.203: 59.4,16.3 U302.1
  Top 0.254: 59.4,16.3 57.8,16.3 56.8,17.3 54.9,17.3 54.05,18.15 R307.2 R309.2
WDT_PET_R
  Top 0.254: J604.2 55.4,26.54 55.4,21.6 54.6,20.8 53.2,20.8 52.9,20.5 R307.1 52.9,20.7 TP609.TP
WDT_SET2
  Top 0.203: R308.1 62.85,17.1
  Top 0.254: U302.6 60.73,17.77 61,17.5 61.9,17.5 62.4,17 62.95,17 R308.1

## Text on the board
tPlace: 5V0_HAT | MCU HEADER | DBG LEDS | EXT TEMP | RST | 5V0_BST | HUMID | POW | TEMP | JUMPER | TEMP | GND | 5V0 | 5V0 | SOFT RESET | CHG | USB | 3V3 | I2C HEADER | PRESSURE | CHG | DONE | SDA | SCL | PRESSURE | 3V3 | GND
bPlace: ADC INPUTS | RASPI / HEADER | AIN0 | AIN1 | AIN2 | MCU HEADER | AIN3 | MCU / RESET / SELECT | ADC | 3V3_HAT | RASPI / RESET / HEADER | IMU | RASPI / LDO / 3.3V SELECT | GND | 2.75V-4.5V / BATTERY INPUT / 1CELL / 3xAA | Y | X | Z | 5V CHARGE / INPUT (500MA) | CHRIS SCHWAB / P17105: HABIP / SPRING 2017 / 002-001-01 | USB